# EAGLE design bellCPU (EAGLE 7.2.0)
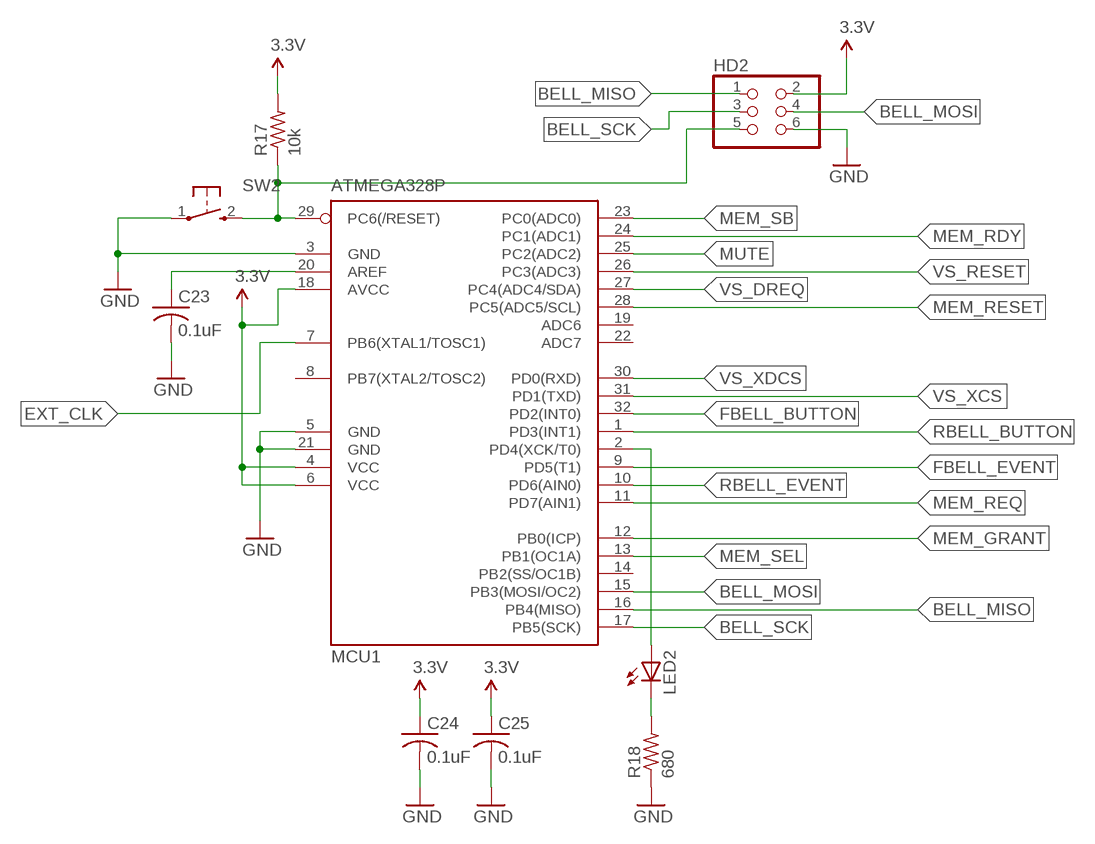
[diagram p0: schematic, sheet 1]

## Parts
C23  0.1uF  CAP0603  [0603_CAP]
C24  0.1uF  CAP0603  [0603_CAP]
C25  0.1uF  CAP0603  [0603_CAP]
HD2  HEADER_2X3  [HEADER_2X3]
LED2  LED0603  [0603_LED]
MCU1  ATMEGA328P  [TQFP32-08]
R17  10k  RESISTOR0603  [0603_RESISTOR]
R18  680  RESISTOR0603  [0603_RESISTOR]
SW2  SWITCH  [SWITCH_TAC]

## Nets
3.3V: C24.1 C25.1 HD2.2 MCU1.4(VCC) MCU1.6(VCC) MCU1.18(AVCC) R17.2
BELL_MISO: HD2.1 MCU1.16(PB4(MISO))
BELL_MOSI: HD2.4 MCU1.15(PB3(MOSI/OC2))
BELL_RESET: HD2.5 MCU1.29(PC6(/RESET)) R17.1 SW2.2
BELL_SCK: HD2.3 MCU1.17(PB5(SCK))
EXT_CLK: MCU1.7(PB6(XTAL1/TOSC1))
FBELL_BUTTON: MCU1.32(PD2(INT0))
FBELL_EVENT: MCU1.9(PD5(T1))
GND: C23.2 C24.2 C25.2 HD2.6 MCU1.3(GND) MCU1.5(GND) MCU1.21(GND) R18.1 SW2.1
MEM_GRANT: MCU1.12(PB0(ICP))
MEM_RDY: MCU1.24(PC1(ADC1))
MEM_REQ: MCU1.11(PD7(AIN1))
MEM_RESET: MCU1.28(PC5(ADC5/SCL))
MEM_SB: MCU1.23(PC0(ADC0))
MEM_SEL: MCU1.13(PB1(OC1A))
MUTE: MCU1.25(PC2(ADC2))
N$7: C23.1 MCU1.20(AREF)
N$17: LED2.C R18.2
N$18: LED2.A MCU1.2(PD4(XCK/T0))
RBELL_BUTTON: MCU1.1(PD3(INT1))
RBELL_EVENT: MCU1.10(PD6(AIN0))
VS_DREQ: MCU1.27(PC4(ADC4/SDA))
VS_RESET: MCU1.26(PC3(ADC3))
VS_XCS: MCU1.31(PD1(TXD))
VS_XDCS: MCU1.30(PD0(RXD))
Unconnected: MCU1.8(PB7(XTAL2/TOSC2)) MCU1.14(PB2(SS/OC1B)) MCU1.19(ADC6) MCU1.22(ADC7)

## Library data of the parts
C23-C25 = jkf:CAP; DIGIKEY#: 399-1096-1-ND
HD2 = jkf:HEADER_2X3; DIGIKEY#: 609-3487-1-ND; MANF: FCI; MANF#: 95278-101A06LF
LED2 = jkf:LED; DIGIKEY#: 516-2493-1-ND; MANF: Avago Technologies; MANF#: HSMG-C191
MCU1 = jkf:ATMEGA328P; DIGIKEY#: ATMEGA328P-AURCT-ND; MANF: Atmel; MANF#: ATMEGA328P-AUR
R17 = jkf:RESISTOR; DIGIKEY#: P10KGCT-ND
R18 = jkf:RESISTOR; DIGIKEY#: P680GCT-ND
SW2 = jkf:SWITCH; DIGIKEY#: EG4576CT-ND; MANF: E-Switch; MANF#: TL3302AF180QJ

## Board
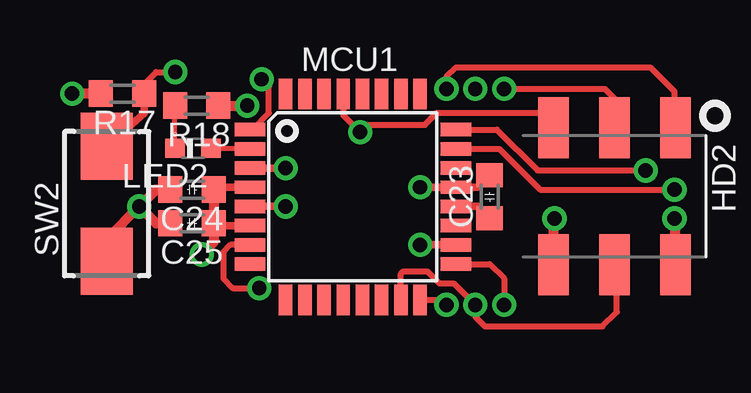
[diagram p1: board, top side]
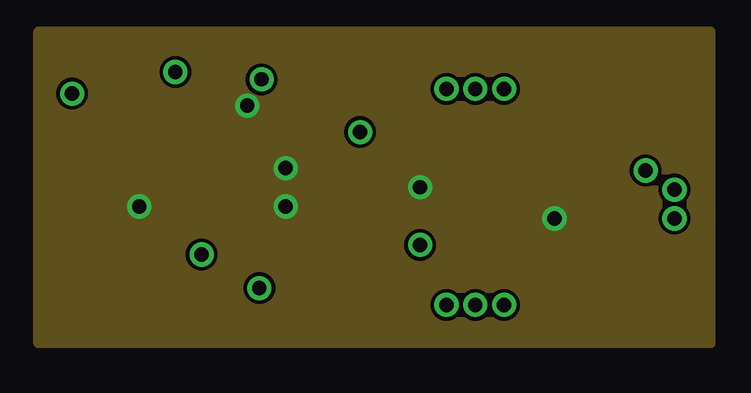
[diagram p2: board, inner layer GND]
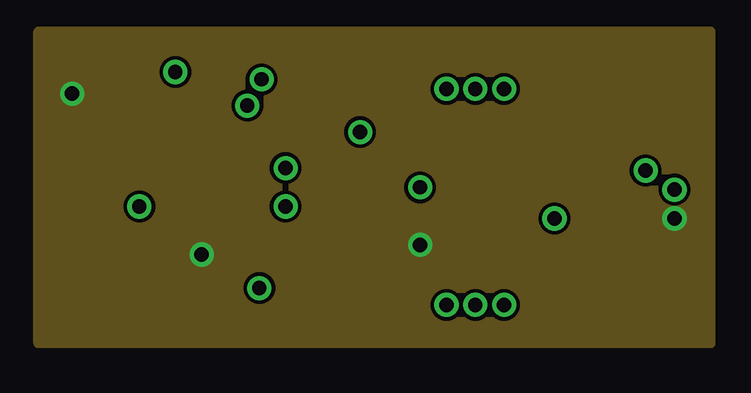
[diagram p3: board, inner layer 3.3V]
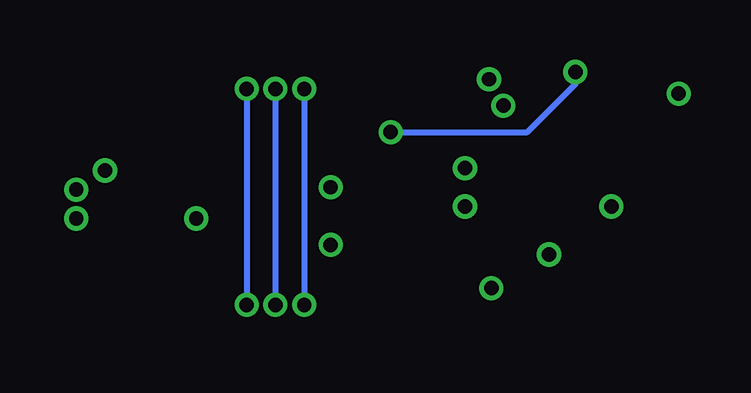
[diagram p4: board, bottom side, seen from below]

No outline drawn. Coordinates in mm, seen from the top.
Copper layers (1+2*15+16): Top 0.0178mm / dielectric 12mil / GND 0.0356mm / dielectric 28mil / 3.3V 0.0356mm / dielectric 12mil / Bottom 0.0178mm
Design rules "SSC-EAGLE-4Lyr_v1.0.0.3": minimum track width 6mil, minimum drill 8mil, track to track 6mil, track to pad 6mil, pad to pad 6mil, via to via 6mil, smd to smd 6mil, copper to edge 20mil, drill to drill 16mil, minimum pad ring 8mil, minimum via ring 8mil, stop-mask expansion 3mil, vias tented up to drill 0mil, thermal gap 10mil

### Footprints (pad centres in the part's own frame; a part is rotated, then mirrored left to right if it is on the bottom)
0603_CAP = smd 1 x 1.1: 1 -0.9,0; 2 0.9,0
HEADER_2X3 = smd 2.54 x 1.27: 1 -2.675,2.54; 2 3.04,2.54; 3 -2.675,0; 4 3.04,0; 5 -2.675,-2.54; 6 3.04,-2.54
0603_LED = smd 0.8 x 0.8: A -0.75,0; C 0.75,0
TQFP32-08 = smd 1.27 x 0.559: 1 -4.293,2.8; 2 -4.293,2; 3 -4.293,1.2; 4 -4.293,0.4; 5 -4.293,-0.4; 6 -4.293,-1.2; 7 -4.293,-2; 8 -4.293,-2.8; 17 4.293,-2.8; 18 4.293,-2; 19 4.293,-1.2; 20 4.293,-0.4; 21 4.293,0.4; 22 4.293,1.2; 23 4.293,2; 24 4.293,2.8 | smd 0.559 x 1.27: 9 -2.8,-4.293; 10 -2,-4.293; 11 -1.2,-4.293; 12 -0.4,-4.293; 13 0.4,-4.293; 14 1.2,-4.293; 15 2,-4.293; 16 2.8,-4.293; 25 2.8,4.293; 26 2,4.293; 27 1.2,4.293; 28 0.4,4.293; 29 -0.4,4.293; 30 -1.2,4.293; 31 -2,4.293; 32 -2.8,4.293
0603_RESISTOR = smd 1 x 1.1: 1 -0.9,0; 2 0.9,0
SWITCH_TAC = smd 2.8 x 2.16: 1 -2.4,-0.02; 2 2.4,-0.02

### Placement (x,y rotation side)
C23  18.8,6.1 90 top
C24  6.4,6.4 180 top
C25  6.4,5 180 top
HD2  24,6.31 270 top
LED2  6.44,8.12 180 top
MCU1  13.1,6.1 0 top
R17  3.5,10.4 180 top
R18  6.6,9.9 180 top
SW2  2.83,5.81 90 top

### Tracks (layer width: path | path; a pad name or v marks a point on that pad's centre or on a via)
3.3V  (via drill 0.6)
  Top 0.305: MCU1.4 7.3,6.5 C24.1 | MCU1.6 7.3,4.9 C25.1 | MCU1.18 v15.9,4.1
  Top 0.406: C24.1 C25.1 | 7.3,4.9 7.3,4.2 v6.8,3.7 | R17.2 v1.4,10.4 | HD2.2 26.54,5.16 v26.5,5.2
  pour 3.3V: 0,13 28,13 28,0 0,0
BELL_MISO  (via drill 0.6)
  Top 0.254: 15.9,1.9 MCU1.16 16.79,1.81 v17,1.6 | v17,10.6 17,11.1 17.4,11.5 25.5,11.5 26.5,10.5 26.5,9.02 HD2.1
  Bottom 0.254: v17,10.6 v17,1.6
BELL_MOSI  (via drill 0.6)
  Top 0.254: MCU1.15 15.1,2.9 15.2,3 16.2,3 16.7,2.5 17.3,2.5 v18.2,1.6 18.2,1.1 18.6,0.7 23.5,0.7 24.1,1.3 24.1,3.16 HD2.4
  Bottom 0.254: v18.2,10.6 v18.2,1.6
BELL_RESET  (via drill 0.6)
  Top 0.254: 13.1,9.1 12.7,9.5 MCU1.29 | 13.1,9.1 16.1,9.1 16.6,9.6 20.84,9.6 HD2.5 | 13.1,9.1 v13.4,8.8 | R17.1 4.4,10.8 4.9,11.3 v5.7,11.3
  Top 0.305: R17.1 4.4,9.58 SW2.2
  Bottom 0.254: v13.4,8.8 7.7,8.8 5.7,10.8 v5.7,11.3
BELL_SCK  (via drill 0.6)
  Top 0.254: MCU1.17 18.8,3.3 19.4,2.7 v19.4,1.6 | v19.4,10.6 23.6,10.6 24.1,10.1 24.1,9.07 HD2.3
  Bottom 0.254: v19.4,10.6 v19.4,1.6
EXT_CLK  (via drill 0.6)
  Top 0.254: MCU1.7 8,4.1 7.7,3.8 7.7,2.7 8.1,2.3 v9.2,2.3
GND  (via drill 0.6)
  Top 0.305: C23.2 18.3,6.5 MCU1.21 v15.9,6.5 | MCU1.5 v10.3,5.7 | MCU1.3 v10.3,7.3
  Top 0.406: R18.1 v8.7,9.9 | HD2.6 21.46,5.16 v21.5,5.2 | C24.2 4.9,6.4 v4.2,5.7 | C25.2 4.9,5 v4.2,5.7 | SW2.1 2.92,4.42 v4.2,5.7
  pour GND: 0,13 28,13 28,0 0,0
MEM_RDY  (via drill 0.6)
  Top 0.254: MCU1.24 19.1,8.9 20.8,7.2 v25.3,7.2
MEM_SB  (via drill 0.6)
  Top 0.254: MCU1.23 19.2,8.1 20.9,6.4 v26.5,6.4
N$7
  Top 0.305: MCU1.20 18.3,5.7 C23.1
N$17
  Top 0.203: LED2.C 5.69,9.89 R18.2
N$18
  Top 0.203: MCU1.2 7.21,8.1 LED2.A
RBELL_BUTTON  (via drill 0.6)
  Top 0.254: MCU1.1 8.9,8.9 9.6,9.6 9.6,10.7 v9.3,11